# Altium project V3.PrjPcb (part 1 of 4)
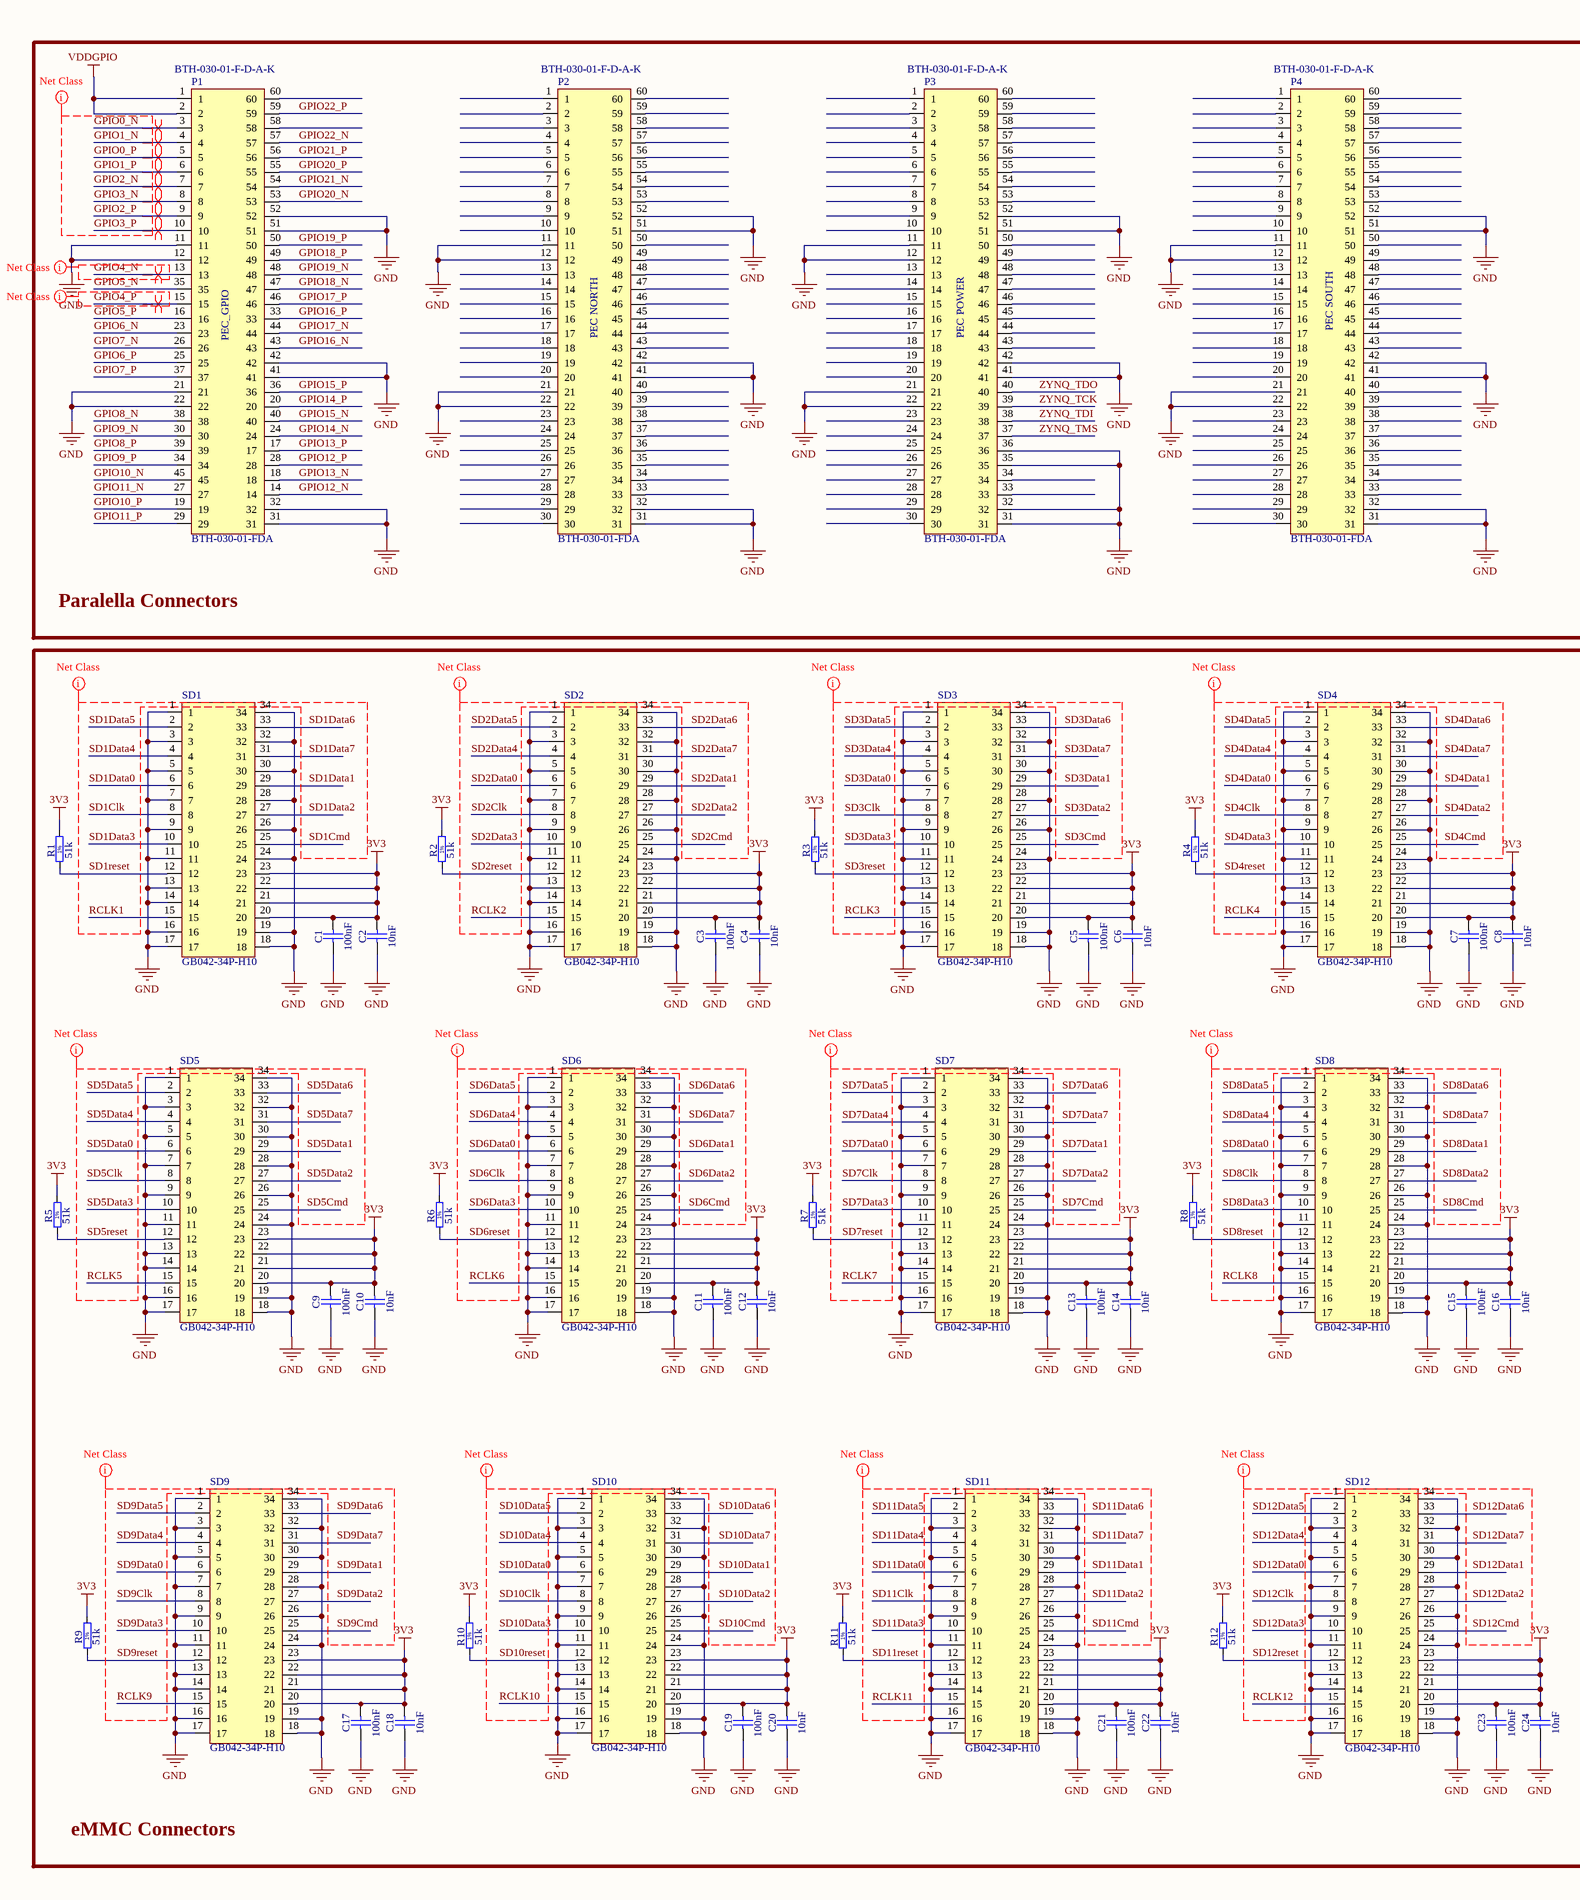
[diagram p0: Connectors.SchDoc, left]
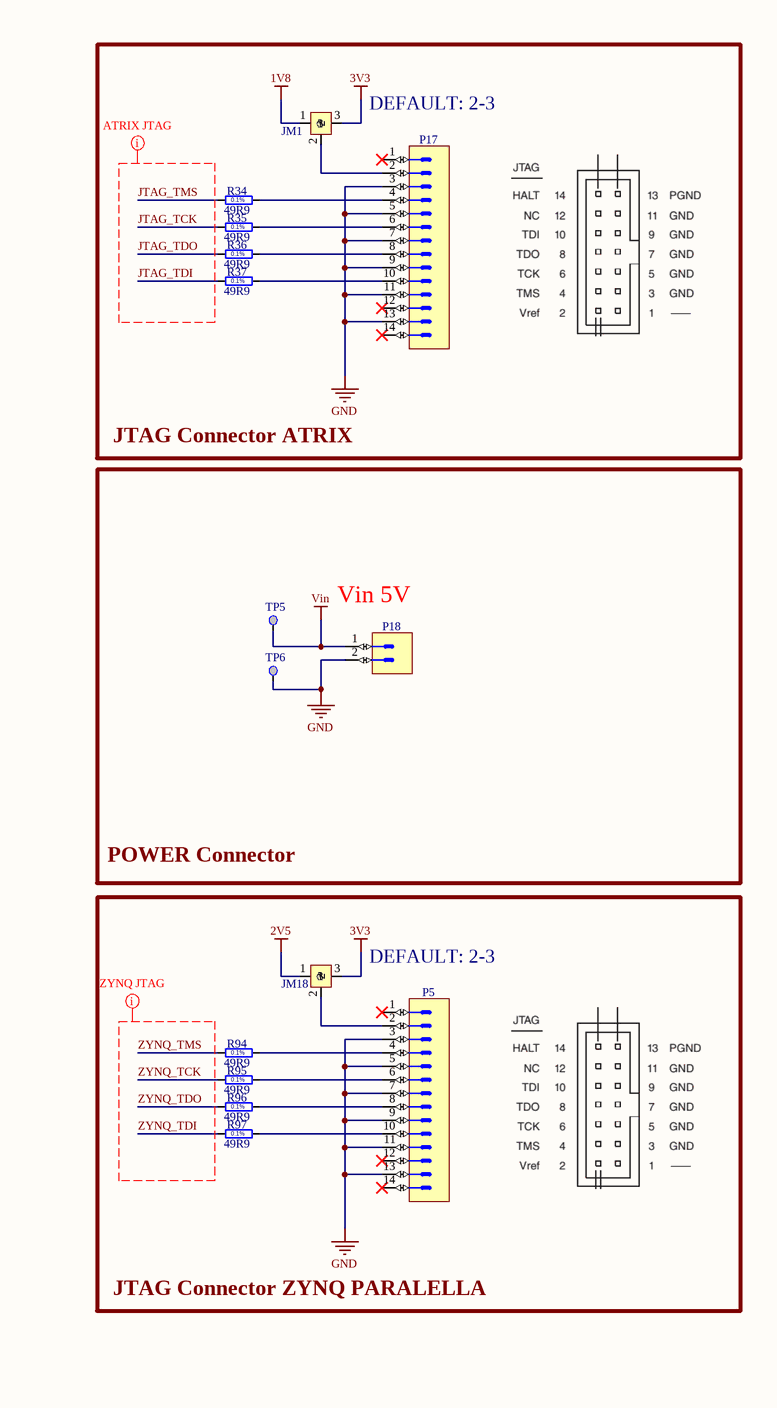
[diagram p1: Connectors.SchDoc, right]
5 sheets, 316 parts. Net scope: global (net labels, ports and power ports of the same name join across sheets).
Board file: PCB.PcbDoc
Sheets:
  Connectors.SchDoc
  WLAN.SchDoc
  ETH_Switch.SchDoc
    Filter = Filter.SchDoc
  Power.SchDoc

## Sheet Connectors.SchDoc
size A2

### Parts
C1  100nF  [CAPC1608X87N]
C2  10nF  [CAPC1608X87N]
C3  100nF  [CAPC1608X87N]
C4  10nF  [CAPC1608X87N]
C5  100nF  [CAPC1608X87N]
C6  10nF  [CAPC1608X87N]
C7  100nF  [CAPC1608X87N]
C8  10nF  [CAPC1608X87N]
C9  100nF  [CAPC1608X87N]
C10  10nF  [CAPC1608X87N]
C11  100nF  [CAPC1608X87N]
C12  10nF  [CAPC1608X87N]
C13  100nF  [CAPC1608X87N]
C14  10nF  [CAPC1608X87N]
C15  100nF  [CAPC1608X87N]
C16  10nF  [CAPC1608X87N]
C17  100nF  [CAPC1608X87N]
C18  10nF  [CAPC1608X87N]
C19  100nF  [CAPC1608X87N]
C20  10nF  [CAPC1608X87N]
C21  100nF  [CAPC1608X87N]
C22  10nF  [CAPC1608X87N]
C23  100nF  [CAPC1608X87N]
C24  10nF  [CAPC1608X87N]
JM1  Jumper 0R  [JUMPER_0R]  (value not drawn)
JM18  Jumper 0R  [JUMPER_0R]  (value not drawn)
P1  BTH-030-01-FDA  Manufacturer Part Number: BTH-030-01-F-D-A-K  [BTH-030-01-F-D-A]
P2  BTH-030-01-FDA  Manufacturer Part Number: BTH-030-01-F-D-A-K  [BTH-030-01-F-D-A]
P3  BTH-030-01-FDA  Manufacturer Part Number: BTH-030-01-F-D-A-K  [BTH-030-01-F-D-A]
P4  BTH-030-01-FDA  Manufacturer Part Number: BTH-030-01-F-D-A-K  [BTH-030-01-F-D-A]
P5  (no value)  [MOLEX_87832-1420]
P17  (no value)  [MOLEX_87832-1420]
P18  KK®  [MOLEX_26-60-4020]  (value not drawn)
R1  51k  [RESC1608X55N]
R2  51k  [RESC1608X55N]
R3  51k  [RESC1608X55N]
R4  51k  [RESC1608X55N]
R5  51k  [RESC1608X55N]
R6  51k  [RESC1608X55N]
R7  51k  [RESC1608X55N]
R8  51k  [RESC1608X55N]
R9  51k  [RESC1608X55N]
R10  51k  [RESC1608X55N]
R11  51k  [RESC1608X55N]
R12  51k  [RESC1608X55N]
R34  49R9  [RESC1608X55N]
R35  49R9  [RESC1608X55N]
R36  49R9  [RESC1608X55N]
R37  49R9  [RESC1608X55N]
R94  49R9  [RESC1608X55N]
R95  49R9  [RESC1608X55N]
R96  49R9  [RESC1608X55N]
R97  49R9  [RESC1608X55N]
SD1  GB042-34P-H10  [GB042-34P-H10]
SD2  GB042-34P-H10  [GB042-34P-H10]
SD3  GB042-34P-H10  [GB042-34P-H10]
SD4  GB042-34P-H10  [GB042-34P-H10]
SD5  GB042-34P-H10  [GB042-34P-H10]
SD6  GB042-34P-H10  [GB042-34P-H10]
SD7  GB042-34P-H10  [GB042-34P-H10]
SD8  GB042-34P-H10  [GB042-34P-H10]
SD9  GB042-34P-H10  [GB042-34P-H10]
SD10  GB042-34P-H10  [GB042-34P-H10]
SD11  GB042-34P-H10  [GB042-34P-H10]
SD12  GB042-34P-H10  [GB042-34P-H10]
TP5  TP  [TP]  (value not drawn)  (no BOM)
TP6  TP  [TP]  (value not drawn)  (no BOM)

### Blocks framed on the sheet
Paralella Connectors: P1-P4
JTAG Connector ATRIX: JM1 P17 R34-R37
Vin 5V: P18 TP5 TP6
eMMC Connectors: C1-C24 R1-R12 SD1-SD12
JTAG Connector ZYNQ PARALELLA: JM18 P5 R94-R97

### Nets
1V8: JM1.1
2V5: JM18.1
3V3: C1.2 C2.2 C3.2 C4.2 C5.2 C6.2 C7.2 C8.2 C9.2 C10.2 C11.2 C12.2 C13.2 C14.2 C15.2 C16.2 C17.2 C18.2 C19.2 C20.2 C21.2 C22.2 C23.2 C24.2 JM1.3 JM18.3 R1.2 R2.2 R3.2 R4.2 R5.2 R6.2 R7.2 R8.2 R9.2 R10.2 R11.2 R12.2 SD1.20 SD1.21 SD1.22 SD1.23 SD2.20 SD2.21 SD2.22 SD2.23 SD3.20 SD3.21 SD3.22 SD3.23 SD4.20 SD4.21 SD4.22 SD4.23 SD5.20 SD5.21 SD5.22 SD5.23 SD6.20 SD6.21 SD6.22 SD6.23 SD7.20 SD7.21 SD7.22 SD7.23 SD8.20 SD8.21 SD8.22 SD8.23 SD9.20 SD9.21 SD9.22 SD9.23 SD10.20 SD10.21 SD10.22 SD10.23 SD11.20 SD11.21 SD11.22 SD11.23 SD12.20 SD12.21 SD12.22 SD12.23
GND: C1.1 C2.1 C3.1 C4.1 C5.1 C6.1 C7.1 C8.1 C9.1 C10.1 C11.1 C12.1 C13.1 C14.1 C15.1 C16.1 C17.1 C18.1 C19.1 C20.1 C21.1 C22.1 C23.1 C24.1 P1.11 P1.12 P1.21 P1.22 P1.31 P1.32 P1.41 P1.42 P1.51 P1.52 P2.11 P2.12 P2.21 P2.22 P2.31 P2.32 P2.41 P2.42 P2.51 P2.52 P3.11 P3.12 P3.21 P3.22 P3.31 P3.32 P3.35 P3.36 P3.41 P3.42 P3.51 P3.52 P4.11 P4.12 P4.21 P4.22 P4.31 P4.32 P4.41 P4.42 P4.51 P4.52 P5.3 P5.5 P5.7 P5.9 P5.11 P5.13 P17.3 P17.5 P17.7 P17.9 P17.11 P17.13 P18.2 SD1.1 SD1.3 SD1.5 SD1.7 SD1.9 SD1.11 SD1.13 SD1.14 SD1.16 SD1.17 SD1.18 SD1.19 SD1.24 SD1.26 SD1.28 SD1.30 SD1.32 SD1.34 SD2.1 SD2.3 SD2.5 SD2.7 SD2.9 SD2.11 SD2.13 SD2.14 SD2.16 SD2.17 SD2.18 SD2.19 SD2.24 SD2.26 SD2.28 SD2.30 SD2.32 SD2.34 SD3.1 SD3.3 SD3.5 SD3.7 SD3.9 SD3.11 SD3.13 SD3.14 SD3.16 SD3.17 SD3.18 SD3.19 SD3.24 SD3.26 SD3.28 SD3.30 SD3.32 SD3.34 SD4.1 SD4.3 SD4.5 SD4.7 SD4.9 SD4.11 SD4.13 SD4.14 SD4.16 SD4.17 SD4.18 SD4.19 SD4.24 SD4.26 SD4.28 SD4.30 SD4.32 SD4.34 SD5.1 SD5.3 SD5.5 SD5.7 SD5.9 SD5.11 SD5.13 SD5.14 SD5.16 SD5.17 SD5.18 SD5.19 SD5.24 SD5.26 SD5.28 SD5.30 SD5.32 SD5.34 SD6.1 SD6.3 SD6.5 SD6.7 SD6.9 SD6.11 SD6.13 SD6.14 SD6.16 SD6.17 SD6.18 SD6.19 SD6.24 SD6.26 SD6.28 SD6.30 SD6.32 SD6.34 SD7.1 SD7.3 SD7.5 SD7.7 SD7.9 SD7.11 SD7.13 SD7.14 SD7.16 SD7.17 SD7.18 SD7.19 SD7.24 SD7.26 SD7.28 SD7.30 SD7.32 SD7.34 SD8.1 SD8.3 SD8.5 SD8.7 SD8.9 SD8.11 SD8.13 SD8.14 SD8.16 SD8.17 SD8.18 SD8.19 SD8.24 SD8.26 SD8.28 SD8.30 SD8.32 SD8.34 SD9.1 SD9.3 SD9.5 SD9.7 SD9.9 SD9.11 SD9.13 SD9.14 SD9.16 SD9.17 SD9.18 SD9.19 SD9.24 SD9.26 SD9.28 SD9.30 SD9.32 SD9.34 SD10.1 SD10.3 SD10.5 SD10.7 SD10.9 SD10.11 SD10.13 SD10.14 SD10.16 SD10.17 SD10.18 SD10.19 SD10.24 SD10.26 SD10.28 SD10.30 SD10.32 SD10.34 SD11.1 SD11.3 SD11.5 SD11.7 SD11.9 SD11.11 SD11.13 SD11.14 SD11.16 SD11.17 SD11.18 SD11.19 SD11.24 SD11.26 SD11.28 SD11.30 SD11.32 SD11.34 SD12.1 SD12.3 SD12.5 SD12.7 SD12.9 SD12.11 SD12.13 SD12.14 SD12.16 SD12.17 SD12.18 SD12.19 SD12.24 SD12.26 SD12.28 SD12.30 SD12.32 SD12.34 TP6.1
VDDGPIO: P1.1 P1.2
Vin: P18.1 TP5.1
GPIO0_N: P1.3
GPIO0_P: P1.5
GPIO1_N: P1.4
GPIO1_P: P1.6
GPIO2_N: P1.7
GPIO2_P: P1.9
GPIO3_N: P1.8
GPIO3_P: P1.10
GPIO4_N: P1.13
GPIO4_P: P1.15
GPIO5_N: P1.35
GPIO5_P: P1.16
GPIO6_N: P1.23
GPIO6_P: P1.25
GPIO7_N: P1.26
GPIO7_P: P1.37
GPIO8_N: P1.38
GPIO8_P: P1.39
GPIO9_N: P1.30
GPIO9_P: P1.34
GPIO10_N: P1.45
GPIO10_P: P1.19
GPIO11_N: P1.27
GPIO11_P: P1.29
GPIO12_N: P1.14
GPIO12_P: P1.28
GPIO13_N: P1.18
GPIO13_P: P1.17
GPIO14_N: P1.24
GPIO14_P: P1.20
GPIO15_N: P1.40
GPIO15_P: P1.36
GPIO16_N: P1.43
GPIO16_P: P1.33
GPIO17_N: P1.44
GPIO17_P: P1.46
GPIO18_N: P1.47
GPIO18_P: P1.49
GPIO19_N: P1.48
GPIO19_P: P1.50
GPIO20_N: P1.53
GPIO20_P: P1.55
GPIO21_N: P1.54
GPIO21_P: P1.56
GPIO22_N: P1.57
GPIO22_P: P1.59
JTAG_TCK: R35.1
JTAG_TDI: R37.1
JTAG_TDO: R36.1
JTAG_TMS: R34.1
RCLK1: SD1.15
RCLK2: SD2.15
RCLK3: SD3.15
RCLK4: SD4.15
RCLK5: SD5.15
RCLK6: SD6.15
RCLK7: SD7.15
RCLK8: SD8.15
RCLK9: SD9.15
RCLK10: SD10.15
RCLK11: SD11.15
RCLK12: SD12.15
SD1Clk: SD1.8
SD1Cmd: SD1.25
SD1Data0: SD1.6
SD1Data1: SD1.29
SD1Data2: SD1.27
SD1Data3: SD1.10
SD1Data4: SD1.4
SD1Data5: SD1.2
SD1Data6: SD1.33
SD1Data7: SD1.31
SD1reset: R1.1 SD1.12
SD2Clk: SD2.8
SD2Cmd: SD2.25
SD2Data0: SD2.6
SD2Data1: SD2.29
SD2Data2: SD2.27
SD2Data3: SD2.10
SD2Data4: SD2.4
SD2Data5: SD2.2
SD2Data6: SD2.33
SD2Data7: SD2.31
SD2reset: R2.1 SD2.12
SD3Clk: SD3.8
SD3Cmd: SD3.25
SD3Data0: SD3.6
SD3Data1: SD3.29
SD3Data2: SD3.27
SD3Data3: SD3.10
SD3Data4: SD3.4
SD3Data5: SD3.2
SD3Data6: SD3.33
SD3Data7: SD3.31
SD3reset: R3.1 SD3.12
SD4Clk: SD4.8
SD4Cmd: SD4.25
SD4Data0: SD4.6
SD4Data1: SD4.29
SD4Data2: SD4.27
SD4Data3: SD4.10
SD4Data4: SD4.4
SD4Data5: SD4.2
SD4Data6: SD4.33
SD4Data7: SD4.31
SD4reset: R4.1 SD4.12
SD5Clk: SD5.8
SD5Cmd: SD5.25
SD5Data0: SD5.6
SD5Data1: SD5.29
SD5Data2: SD5.27
SD5Data3: SD5.10
SD5Data4: SD5.4
SD5Data5: SD5.2
SD5Data6: SD5.33
SD5Data7: SD5.31
SD5reset: R5.1 SD5.12
SD6Clk: SD6.8
SD6Cmd: SD6.25
SD6Data0: SD6.6
SD6Data1: SD6.29
SD6Data2: SD6.27
SD6Data3: SD6.10
SD6Data4: SD6.4
SD6Data5: SD6.2
SD6Data6: SD6.33
SD6Data7: SD6.31
SD6reset: R6.1 SD6.12
SD7Clk: SD7.8
SD7Cmd: SD7.25
SD7Data0: SD7.6
SD7Data1: SD7.29
SD7Data2: SD7.27
SD7Data3: SD7.10
SD7Data4: SD7.4
SD7Data5: SD7.2
SD7Data6: SD7.33
SD7Data7: SD7.31
SD7reset: R7.1 SD7.12
SD8Clk: SD8.8
SD8Cmd: SD8.25
SD8Data0: SD8.6
SD8Data1: SD8.29
SD8Data2: SD8.27
SD8Data3: SD8.10
SD8Data4: SD8.4
SD8Data5: SD8.2
SD8Data6: SD8.33
SD8Data7: SD8.31
SD8reset: R8.1 SD8.12
SD9Clk: SD9.8
SD9Cmd: SD9.25
SD9Data0: SD9.6
SD9Data1: SD9.29
SD9Data2: SD9.27
SD9Data3: SD9.10
SD9Data4: SD9.4
SD9Data5: SD9.2
SD9Data6: SD9.33
SD9Data7: SD9.31
SD9reset: R9.1 SD9.12
SD10Clk: SD10.8
SD10Cmd: SD10.25
SD10Data0: SD10.6
SD10Data1: SD10.29
SD10Data2: SD10.27
SD10Data3: SD10.10
SD10Data4: SD10.4
SD10Data5: SD10.2
SD10Data6: SD10.33
SD10Data7: SD10.31
SD10reset: R10.1 SD10.12
SD11Clk: SD11.8
SD11Cmd: SD11.25
SD11Data0: SD11.6
SD11Data1: SD11.29
SD11Data2: SD11.27
SD11Data3: SD11.10
SD11Data4: SD11.4
SD11Data5: SD11.2
SD11Data6: SD11.33
SD11Data7: SD11.31
SD11reset: R11.1 SD11.12
SD12Clk: SD12.8
SD12Cmd: SD12.25
SD12Data0: SD12.6
SD12Data1: SD12.29
SD12Data2: SD12.27
SD12Data3: SD12.10
SD12Data4: SD12.4
SD12Data5: SD12.2
SD12Data6: SD12.33
SD12Data7: SD12.31
SD12reset: R12.1 SD12.12
ZYNQ_TCK: P3.39 R95.1
ZYNQ_TDI: P3.38 R97.1
ZYNQ_TDO: P3.40 R96.1
ZYNQ_TMS: P3.37 R94.1
NetJM1_2: JM1.2 P17.2
NetJM18_2: JM18.2 P5.2
NetP5_4: P5.4 R94.2
NetP5_6: P5.6 R95.2
NetP5_8: P5.8 R96.2
NetP5_10: P5.10 R97.2
NetP17_4: P17.4 R34.2
NetP17_6: P17.6 R35.2
NetP17_8: P17.8 R36.2
NetP17_10: P17.10 R37.2

Not connected (* = marked no-connect by the designer): P1 58 60 HOLE; P2 1 2 3 4 5 6 7 8 9 10 13 14 15 16 17 18 19 20 23 24 25 26 27 28 29 30 33 34 35 36 37 38 39 40 43 44 45 46 47 48 49 50 53 54 55 56 57 58 59 60 HOLE; P3 1 2 3 4 5 6 7 8 9 10 13 14 15 16 17 18 19 20 23 24 25 26 27 28 29 30 33 34 43 44 45 46 47 48 49 50 53 54 55 56 57 58 59 60 HOLE; P4 1 2 3 4 5 6 7 8 9 10 13 14 15 16 17 18 19 20 23 24 25 26 27 28 29 30 33 34 35 36 37 38 39 40 43 44 45 46 47 48 49 50 53 54 55 56 57 58 59 60 HOLE; P5 1* 12* 14* HOLE; P17 1* 12* 14* HOLE

### Layout directives
differential pair: GPIO0_N, GPIO0_P, GPIO1_N, GPIO1_P, GPIO2_N, GPIO2_P, GPIO3_N, GPIO3_P, GPIO4_N, GPIO4_P
net class SD1: RCLK1, SD1Clk, SD1Cmd, SD1Data0, SD1Data1, SD1Data2, SD1Data3, SD1Data4, SD1Data5, SD1Data6, SD1Data7, SD1reset
net class SD2: RCLK2, SD2Clk, SD2Cmd, SD2Data0, SD2Data1, SD2Data2, SD2Data3, SD2Data4, SD2Data5, SD2Data6, SD2Data7, SD2reset
net class SD3: RCLK3, SD3Clk, SD3Cmd, SD3Data0, SD3Data1, SD3Data2, SD3Data3, SD3Data4, SD3Data5, SD3Data6, SD3Data7, SD3reset
net class SD4: RCLK4, SD4Clk, SD4Cmd, SD4Data0, SD4Data1, SD4Data2, SD4Data3, SD4Data4, SD4Data5, SD4Data6, SD4Data7, SD4reset
net class SD5: RCLK5, SD5Clk, SD5Cmd, SD5Data0, SD5Data1, SD5Data2, SD5Data3, SD5Data4, SD5Data5, SD5Data6, SD5Data7, SD5reset
net class SD6: RCLK6, SD6Clk, SD6Cmd, SD6Data0, SD6Data1, SD6Data2, SD6Data3, SD6Data4, SD6Data5, SD6Data6, SD6Data7, SD6reset
net class SD7: RCLK7, SD7Clk, SD7Cmd, SD7Data0, SD7Data1, SD7Data2, SD7Data3, SD7Data4, SD7Data5, SD7Data6, SD7Data7, SD7reset
net class SD8: RCLK8, SD8Clk, SD8Cmd, SD8Data0, SD8Data1, SD8Data2, SD8Data3, SD8Data4, SD8Data5, SD8Data6, SD8Data7, SD8reset
net class SD9: RCLK9, SD9Clk, SD9Cmd, SD9Data0, SD9Data1, SD9Data2, SD9Data3, SD9Data4, SD9Data5, SD9Data6, SD9Data7, SD9reset
net class SD10: RCLK10, SD10Clk, SD10Cmd, SD10Data0, SD10Data1, SD10Data2, SD10Data3, SD10Data4, SD10Data5, SD10Data6, SD10Data7, SD10reset
net class SD11: RCLK11, SD11Clk, SD11Cmd, SD11Data0, SD11Data1, SD11Data2, SD11Data3, SD11Data4, SD11Data5, SD11Data6, SD11Data7, SD11reset
net class SD12: RCLK12, SD12Clk, SD12Cmd, SD12Data0, SD12Data1, SD12Data2, SD12Data3, SD12Data4, SD12Data5, SD12Data6, SD12Data7, SD12reset
net class GPIO: GPIO0_N, GPIO0_P, GPIO1_N, GPIO1_P, GPIO2_N, GPIO2_P, GPIO3_N, GPIO3_P, GPIO4_N, GPIO4_P
net class ZYNQ JTAG: ZYNQ_TCK, ZYNQ_TDI, ZYNQ_TDO, ZYNQ_TMS
net class ATRIX JTAG: JTAG_TCK, JTAG_TDI, JTAG_TDO, JTAG_TMS

### Notes on the sheet
- DEFAULT: 2-3
- (near P1) PEC_GPIO
- (near P2) PEC NORTH
- (near P3) PEC POWER
- (near P4) PEC SOUTH
- POWER Connector
- Title
- Size:
- Date:
- File:
- A2
- Number:
- Time:
- Revision:
- Sheet
- of
- (in symbol R0603_49R9_0.1%_0.063W_10PPM) 0.1%
- (in symbol R0603_51K_1%_0.1W_100PPM) 1%

### Library data of the parts
C1 C3 C5 C7 C9 C11 C13 C15 C17 C19 C21 C23 = CC0603_100NF_50V_10%_X7R: Non-polarised capacitor; Part Description: SMD Multilayer Chip Ceramic Capacitor; Manufacturer: MULTICOMP; Manufacturer Part Number: MCB0603R104KCT; Manufacturer1 Part Number: 223858615649; Voltage: 50V; TC: X7R; Tolerance: ±10%; Table: Capacitors SMD; Voltage Rating: 16; Capacitance: 0.1; SVHC: No SVHC (17-Dec-2015); Ceramic Capacitor Case: 0603 [1608 Metric]; Dielectric Characteristic: X7; Product Range: MCB Series; Capacitance Tolerance: ± 10%; Capacitor Terminals: SMD; Description: MULTICOMP - MCB0603R104KCT - CAP, MLCC, X7R, 100NF, 16V, 0603; Part Number: CC0603_100NF_50V_10%_X7R; Component Kind: Standard; Component Type: Standard; Pin Count: 2; Value: 100nF; Status: Preferred; Case: 0603; Mounted: Yes; Socket: No; SMD: Yes; Manufacturer1 Example: PHYCOMP; Manufacturer1 ComponentHeight: 0.87mm; HelpURL: \\cern.ch\dfs\Applications\Altium\Datasheets\CC0603_X7R_PHYCOMP.pdf; Author: CERN DEM JLC; CreateDate: 3.12.2007; LatestRevisionDate: 3.12.2007; RoHS: YES; Packaging: Cut Tape; Operating Temperature Min: -55; MSL: -; Supplier Part Number: 9406140; Operating Temperature Range: -55°C to +125°C<!--FANDB--><div class="features-and-benefits-container"><div class="features-and-benefits-description"><span class="features-benefits-value">The MCB0603R104KCT is a multilayer Ceramic Capacitor with 0603 chip, for general digital circuit. Consists of a conducting material and electrodes. To manufacture a chip-type SMT and achieve miniaturization, high density and high efficiency, ceramic condensers are used. MLCC is made by X7; Supplier: Farnell; Capacitance Tolerance ±: ± 10%; Operating Temperature Max: 125
C2 C4 C6 C8 C10 C12 C14 C16 C18 C20 C22 C24 = CC0603_10NF_50V_10%_X7R: Non-polarised capacitor; Part Description: SMD Multilayer Chip Ceramic Capacitor; Manufacturer: MULTICOMP; Manufacturer Part Number: MC0603B103K500CT; Manufacturer1 Part Number: 223858615636; Voltage: 50V; TC: X7R; Tolerance: ±10%; Table: Capacitors SMD; Voltage Rating: 50; Product Range: MC Series; No. of Pins: 2; Capacitor Terminals: SMD; Ceramic Capacitor Case: 0603 [1608 Metric]; SVHC: No SVHC (17-Dec-2015); Capacitance Tolerance ±: ± 10%; External Length / Height: 0.8; Dielectric Characteristic: X7; External Depth: 1.6; Description: MULTICOMP - MC0603B103K500CT - CAP, MLCC, X7R, 10NF, 50V, 0603; Capacitance: 0.01; Part Number: CC0603_10NF_50V_10%_X7R; Component Kind: Standard; Component Type: Standard; Pin Count: 2; Value: 10nF; Status: Preferred; Case: 0603; Mounted: Yes; Socket: No; SMD: Yes; Manufacturer1 Example: PHYCOMP; Manufacturer1 ComponentHeight: 0.87mm; HelpURL: \\cern.ch\dfs\Applications\Altium\Datasheets\CC0603_X7R_PHYCOMP.pdf; Author: CERN DEM JLC; CreateDate: 3.12.2007; LatestRevisionDate: 3.12.2007; Operating Temperature Range: -55°C to +125°C<!--FANDB--><div class="features-and-benefits-container"><div class="features-and-benefits-description"><span class="features-benefits-value">The Multicomp MC series is general purpose MLCC capacitors with X7R dielectric material which provides high electrical precision, stability and reliability. This MLCC capacitor consists of a conducting material and electrodes with high density and high efficiency ceramic condensers.</span></div><div class="features-and-benefits-list"><ul class="features-and-benefits-list-list"><li class="features-and-benefits-list-item">Small size with higher capacitance values</li><li class="features-and-benefits-list-item">0201, 0402, 0603, 0805, 1206, 1210, 1812 case sizes available</li><li class="features-and-benefits-list-item">Capacitance value ranging from 100pF to 47?F</li><li class="features-and-benefits-list-item">Capacitor with lead free termination (pure Tin)</li><li class="features-and-benefits-list-item">High electrical precision, stability and reliability</li><li class="features-and-benefits-list-item">Rated voltage of 6.3V, 10V, 16V, 25V, 50V, 100V</li><li class="features-and-benefits-list-item">Operating temperature of -55°C to +125°C</li><li class="features-and-benefits-list-item">Available in ±5%, ±10% and ±20; MSL: -; Supplier: Farnell; Capacitance Tolerance: ± 10%; External Width: 0.8; Supplier Part Number: 1759102; Packaging: Cut Tape; Operating Temperature Max: 125; Operating Temperature Min: -55; RoHS: YES
P1-P4 = BTH-030-01-FDA: Connector Parallela; Manufacturer: Samtec; Description: Conn Micro Terminal HDR 60 POS 0.5mm Solder ST SMD; Octopart Url: http://octopart.com/bth-030-01-f-d-a-k-samtec-10613276; OctopartID: 57659ece801f88a2; Supplier: Octopart; Seller Landing  Url: https://octopart-clicks.com/click/track?country=TR&ak=8157f166&sig=0dabfe7&sid=15544&ppid=10613276&vpid=76082636&ct=offers; Supplier Part Number: Avnet Europe - BTH-030-01-F-D-A-K
P5 P17 = Connector 14 Male: Manufacturer Part Number: 0878321420; Manufacturer: Molex, LLC; Connector Type: Header, Shrouded; Number of Positions: 14; Number of Positions Loaded: All; Pitch: 0.079" (2.00mm); Category: Connectors, Interconnects; Supplier Part Number: WM18641-ND; Supplier: Digi-Key; RoHS: RoHS Compliant; Packaging: Tube; Contact Type: Male Pin; Number of Rows: 2; Row Spacing: 0.079" (2.00mm); Contact Mating Length: 0.141" (3.60mm); Mounting Type: Surface Mount; Termination: Solder; Fastening Type: -; Features: Board Guide; Contact Finish: Gold; Contact Finish Thickness: 15µin (0.38µm); Color: Black
P18 = MOLEX_26-60-4020: Connector 2 Male; Part Description: 3.96mm (.156") Pitch KK® Solid Header, Vertical, Friction Lock, 2 Circuits, Tin (Sn) Plating; Manufacturer: Molex, LLC; Manufacturer Part Number: 0026604020; Table: MOLEX; Number of Positions: 2; Connector Type: Header, Unshrouded; Pitch: 0.156" (3.96mm); Number of Positions Loaded: All; Part Number: MOLEX_26-60-4020; Component Kind: Standard; Component Type: Standard; Pin Count: 2; Family: KK®; Mounted: Yes; Socket: No; SMD: No; Status: None; ComponentHeight: 14.73mm; HelpURL: \\cern.ch\dfs\Applications\Altium\Datasheets\MOLEX_26-60-4020.pdf; Author: CERN DEM JLC; CreateDate: 6.04.2011; LatestRevisionDate: 6.04.2011; Contact Mating Length: 0.450" (11.43mm); Termination: Solder; Fastening Type: Friction Lock; Supplier Part Number: WM4620-ND; Contact Finish Thickness: 60µin (1.52µm); Mounting Type: Through Hole; Contact Type: Male Pin; Row Spacing: -; Supplier: Digi-Key; Contact Finish: Tin; Number of Rows: 1; RoHS: RoHS Compliant; Packaging: Bulk; Category: Connectors, Interconnects; Features: -; Color: Natural
R1-R12 = R0603_51K_1%_0.1W_100PPM: Resistor - 1%; Part Description: General Purpose Thick Film Chip Resistor; Manufacturer: Yageo; Manufacturer Part Number: RC0603JR-0751KL; Manufacturer1 Part Number: NRC06F5102TRF; Power: 0.1W; TC: ±100ppm/°C; Tolerance: ±5%; Table: Resistors SMD; Description: RES SMD 51K OHM 5% 1/10W 0603; Power (Watts): 0.1W, 1/10W; Part Number: R0603_51K_1%_0.1W_100PPM; Component Kind: Standard; Component Type: Standard; Pin Count: 2; Value: 51k; Status: Preferred; Case: 0603; Mounted: Yes; Socket: No; SMD: Yes; Manufacturer1 Example: NIC COMPONENT; Manufacturer1 ComponentHeight: 0.55mm; HelpURL: \\cern.ch\dfs\Applications\Altium\Datasheets\R0603_NIC_NRC.pdf; Author: CERN DEM JLC; CreateDate: 3.12.2007; LatestRevisionDate: 13.03.2008; Height: 0.022" (0.55mm); Features: Moisture Resistant; RoHS: RoHS Compliant; Number of Terminations: 2; Category: Resistors; Composition: Thick Film; Resistance (Ohms): 51k; Size / Dimension: 0.063" L x 0.031" W (1.60mm x 0.80mm); Supplier Part Number: 311-51KGRCT-ND; Supplier Device Package: 0603; Package / Case: 0603 (1608 Metric); Supplier: Digi-Key; Temperature Coefficient: ±100ppm/°C; Packaging: Cut Tape (CT); Operating Temperature: -55°C ~ 155°C
R34-R37 R94-R97 = R0603_49R9_0.1%_0.063W_10PPM: Resistor - 0.1%; Part Description: Thin Film Chip Resistor; Manufacturer: Panasonic Electronic Components; Manufacturer Part Number: ERJ-3EKF49R9V; Manufacturer1 Part Number: RN73C1J49R9BTDF; Power: 0.063W; TC: ±10ppm; Tolerance: ±1%; Table: Resistors SMD; Power (Watts): 0.1W, 1/10W; Resistance (Ohms): 49.9; Description: RES SMD 49.9 OHM 1% 1/10W 0603; Temperature Coefficient: ±100ppm/°C; Part Number: R0603_49R9_0.1%_0.063W_10PPM; Component Kind: Standard; Component Type: Standard; Pin Count: 2; Value: 49R9; Status: Not recommended; Case: 0603; Mounted: Yes; Socket: No; SMD: Yes; Manufacturer1 Example: TYCO HOLSWORTHY; Manufacturer1 ComponentHeight: 0.5mm; HelpURL: \\cern.ch\dfs\Applications\Altium\Datasheets\R0603_Tyco_RN73.pdf; Author: CERN DEM JLC; CreateDate: 3.12.2007; LatestRevisionDate: 13.03.2008; Package / Case: 0603 (1608 Metric); Category: Resistors; Supplier: Digi-Key; Number of Terminations: 2; Packaging: Cut Tape (CT); Composition: Thick Film; Supplier Device Package: 0603; Height: 0.022" (0.55mm); Size / Dimension: 0.063" L x 0.031" W (1.60mm x 0.80mm); Features: Automotive AEC-Q200; Supplier Part Number: P49.9HCT-ND; RoHS: RoHS Compliant; Operating Temperature: -55°C ~ 155°C
SD1-SD12 = GB042-34P-H10: Connector, eMMC
TP5 TP6 = Test Point

## Sheet WLAN.SchDoc
size A3
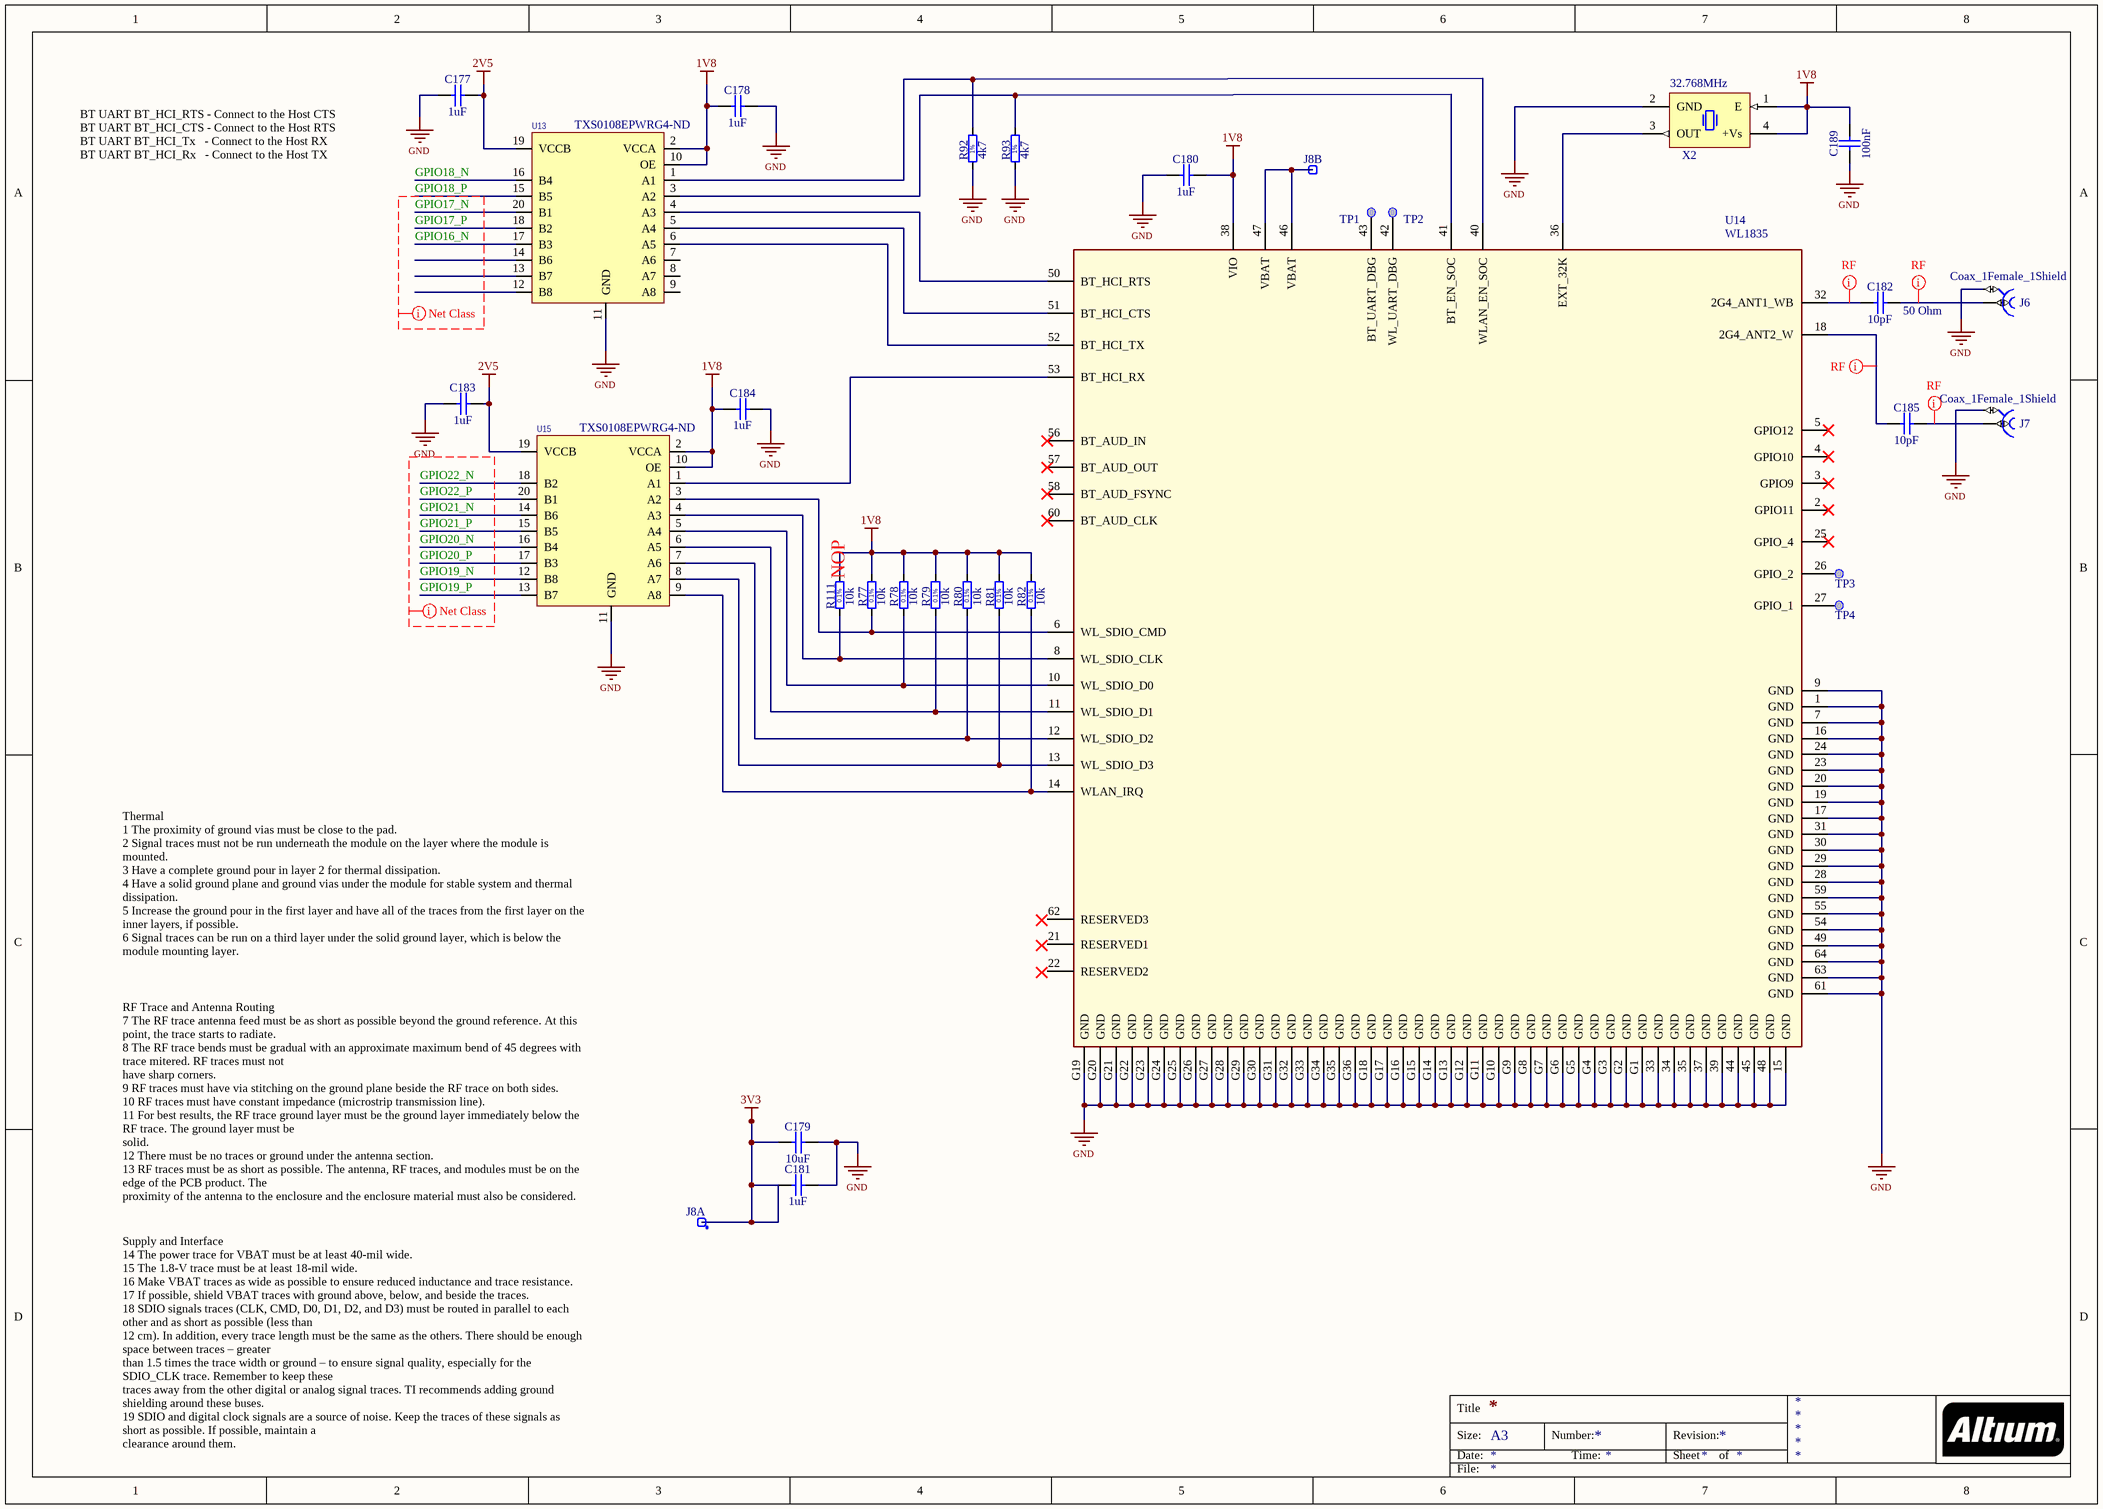
[diagram p2: WLAN.SchDoc]

### Parts
C177  1uF  [CAPC1608X87N]
C178  1uF  [CAPC1608X87N]
C179  10uF  [CAPC2012X135N]
C180  1uF  [CAPC1608X87N]
C181  1uF  [CAPC1608X87N]
C182  10pF  [CAPC1608X87N]
C183  1uF  [CAPC1608X87N]
C184  1uF  [CAPC1608X87N]
C185  10pF  [CAPC1608X87N]
C189  100nF  [CAPC1608X87N]
J6  Coax_1Female_1Shield  [HUBER-SUHNER_82 SMA-50-0-41/133 NE]
J7  Coax_1Female_1Shield  [HUBER-SUHNER_82 SMA-50-0-41/133 NE]
J8  Test Point  [COMATEL_385.0358.1.02.400]  (value not drawn)  (parts A,B of 2)
R77  10k  [RESC1608X55N]
R78  10k  [RESC1608X55N]
R79  10k  [RESC1608X55N]
R80  10k  [RESC1608X55N]
R81  10k  [RESC1608X55N]
R82  10k  [RESC1608X55N]
R92  4k7  [RESC1608X55N]
R93  4k7  [RESC1608X55N]
R111  10k  [RESC1608X55N]
TP1  TP  [TP]  (value not drawn)  (no BOM)
TP2  TP  [TP]  (value not drawn)  (no BOM)
TP3  TP  [TP]  (value not drawn)  (no BOM)
TP4  TP  [TP]  (value not drawn)  (no BOM)
U13  Supplier Part Number: TXS0108EPWRG4-ND  [SOP65P640X120-20N]  (hidden comment: TXS0108EPWR)
U14  WL1835  [E-13.4X13.3-N100_0.75-TOP]
U15  Supplier Part Number: TXS0108EPWRG4-ND  [SOP65P640X120-20N]  (hidden comment: TXS0108EPWR)
X2  32.768MHz  [OSCSC508P500X700X180-4N]

### Nets
1V8: C178.1 C180.2 C184.1 C189.2 R77.2 R78.2 R79.2 R80.2 R81.2 R82.2 R111.2 U13.2(VCCA) U13.10(OE) U14.38(VIO) U15.2(VCCA) U15.10(OE) X2.1(E) X2.4(+Vs)
2V5: C177.2 C183.2 U13.19(VCCB) U15.19(VCCB)
3V3: C179.1 C181.1 J8.1
GND: C177.1 C178.2 C179.2 C180.1 C181.2 C183.1 C184.2 C189.1 J6.2 J7.2 R92.1 R93.1 U13.11(GND) U14.1(GND) U14.7(GND) U14.9(GND) U14.15(GND) U14.16(GND) U14.17(GND) U14.19(GND) U14.20(GND) U14.23(GND) U14.24(GND) U14.28(GND) U14.29(GND) U14.30(GND) U14.31(GND) U14.33(GND) U14.34(GND) U14.35(GND) U14.37(GND) U14.39(GND) U14.44(GND) U14.45(GND) U14.48(GND) U14.49(GND) U14.54(GND) U14.55(GND) U14.59(GND) U14.61(GND) U14.63(GND) U14.64(GND) U14.G1(GND) U14.G2(GND) U14.G3(GND) U14.G4(GND) U14.G5(GND) U14.G6(GND) U14.G7(GND) U14.G8(GND) U14.G9(GND) U14.G10(GND) U14.G11(GND) U14.G12(GND) U14.G13(GND) U14.G14(GND) U14.G15(GND) U14.G16(GND) U14.G17(GND) U14.G18(GND) U14.G19(GND) U14.G20(GND) U14.G21(GND) U14.G22(GND) U14.G23(GND) U14.G24(GND) U14.G25(GND) U14.G26(GND) U14.G27(GND) U14.G28(GND) U14.G29(GND) U14.G30(GND) U14.G31(GND) U14.G32(GND) U14.G33(GND) U14.G34(GND) U14.G35(GND) U14.G36(GND) U15.11(GND) X2.2(GND)
GPIO16_N: U13.17(B3)
GPIO17_N: U13.20(B1)
GPIO17_P: U13.18(B2)
GPIO18_N: U13.16(B4)
GPIO18_P: U13.15(B5)
GPIO19_N: U15.12(B8)
GPIO19_P: U15.13(B7)
GPIO20_N: U15.16(B4)
GPIO20_P: U15.17(B3)
GPIO21_N: U15.14(B6)
GPIO21_P: U15.15(B5)
GPIO22_N: U15.18(B2)
GPIO22_P: U15.20(B1)
NetC182_1: C182.1 U14.32(2G4_ANT1_WB)
NetC182_2: C182.2 J6.1
NetC185_1: C185.1 U14.18(2G4_ANT2_W)
NetC185_2: C185.2 J7.1
NetJ8_2: J8.2 U14.46(VBAT) U14.47(VBAT)
NetR77_1: R77.1 U14.6(WL_SDIO_CMD) U15.3(A2)
NetR78_1: R78.1 U14.10(WL_SDIO_D0) U15.5(A4)
NetR79_1: R79.1 U14.11(WL_SDIO_D1) U15.6(A5)
NetR80_1: R80.1 U14.12(WL_SDIO_D2) U15.7(A6)
NetR81_1: R81.1 U14.13(WL_SDIO_D3) U15.8(A7)
NetR82_1: R82.1 U14.14(WLAN_IRQ) U15.9(A8)
NetR92_2: R92.2 U13.1(A1) U14.40(WLAN_EN_SOC)
NetR93_2: R93.2 U13.3(A2) U14.41(BT_EN_SOC)
NetR111_1: R111.1 U14.8(WL_SDIO_CLK) U15.4(A3)
NetTP1_1: TP1.1 U14.43(BT_UART_DBG)
NetTP2_1: TP2.1 U14.42(WL_UART_DBG)
NetTP3_1: TP3.1 U14.26(GPIO_2)
NetTP4_1: TP4.1 U14.27(GPIO_1)
NetU13_4: U13.4(A3) U14.50(BT_HCI_RTS)
NetU13_5: U13.5(A4) U14.51(BT_HCI_CTS)
NetU13_6: U13.6(A5) U14.52(BT_HCI_TX)
NetU14_36: U14.36(EXT_32K) X2.3(OUT)
NetU14_53: U14.53(BT_HCI_RX) U15.1(A1)

Not connected (* = marked no-connect by the designer): U13 7(A6) 8(A7) 9(A8) 12(B8) 13(B7) 14(B6); U14 2(GPIO11)* 3(GPIO9)* 4(GPIO10)* 5(GPIO12)* 21(RESERVED1) 22(RESERVED2) 25(GPIO_4)* 56(BT_AUD_IN)* 57(BT_AUD_OUT)* 58(BT_AUD_FSYNC)* 60(BT_AUD_CLK)* 62(RESERVED3)

### Layout directives
net class RF: NetC182_1, NetC182_2, NetC185_1, NetC185_2
net class WLAN_SPI: GPIO19_N, GPIO19_P, GPIO20_N, GPIO20_P, GPIO21_N, GPIO21_P, GPIO22_N, GPIO22_P
net class BLU_SPI: GPIO16_N, GPIO17_N, GPIO17_P, GPIO18_P

### Notes on the sheet
- BT UART	BT_HCI_RTS - Connect to the Host CTS
  BT UART	BT_HCI_CTS - Connect to the Host RTS
  BT UART	BT_HCI_Tx   - Connect to the Host RX
  BT UART	BT_HCI_Rx   - Connect to the Host TX
- (near C182) 50 Ohm
- (near R111) NOP
- Thermal
  1 The proximity of ground vias must be close to the pad.
  2 Signal traces must not be run underneath the module on the layer where the module is mounted.
  3 Have a complete ground pour in layer 2 for thermal dissipation.
  4 Have a solid ground plane and ground vias under the module for stable system and thermal dissipation.
  5 Increase the ground pour in the first layer and have all of the traces from the first layer on the inner layers, if possible.
  6 Signal traces can be run on a third layer under the solid ground layer, which is below the module mounting layer.
- RF Trace and Antenna Routing
  7 The RF trace antenna feed must be as short as possible beyond the ground reference. At this point, the trace starts to radiate.
  8 The RF trace bends must be gradual with an approximate maximum bend of 45 degrees with trace mitered. RF traces must not
  have sharp corners.
  9 RF traces must have via stitching on the ground plane beside the RF trace on both sides.
  10 RF traces must have constant impedance (microstrip transmission line).
  11 For best results, the RF trace ground layer must be the ground layer immediately below the RF trace. The ground layer must be
  solid.
  12 There must be no traces or ground under the antenna section.
  13 RF traces must be as short as possible. The antenna, RF traces, and modules must be on the edge of the PCB product. The
  proximity of the antenna to the enclosure and the enclosure material must also be considered.
- Supply and Interface
  14 The power trace for VBAT must be at least 40-mil wide.
  15 The 1.8-V trace must be at least 18-mil wide.
  16 Make VBAT traces as wide as possible to ensure reduced inductance and trace resistance.
  17 If possible, shield VBAT traces with ground above, below, and beside the traces.
  18 SDIO signals traces (CLK, CMD, D0, D1, D2, and D3) must be routed in parallel to each other and as short as possible (less than
  12 cm). In addition, every trace length must be the same as the others. There should be enough space between traces – greater
  than 1.5 times the trace width or ground – to ensure signal quality, especially for the SDIO_CLK trace. Remember to keep these
  traces away from the other digital or analog signal traces. TI recommends adding ground shielding around these buses.
  19 SDIO and digital clock signals are a source of noise. Keep the traces of these signals as short as possible. If possible, maintain a
  clearance around them.
- Title
- Size:
- Date:
- A3
- Number:
- Time:
- Revision:
- Sheet
- of
- File:
- (in symbol R0603_4K7_1%_0.1W_100PPM) 1%
- (in symbol R0603_10K_0.1%_0.063W_10PPM) 0.1%

### Library data of the parts
C177 C178 C180 C181 C183 C184 = CC0603_1UF_25V_10%_X7R: Non-polarised capacitor; Part Description: SMD Multilayer Chip Ceramic Capacitor; Manufacturer: MULTICOMP; Manufacturer Part Number: MC0603F104Z250CT; Manufacturer1 Part Number: GRM188R71E105KA12D; Voltage: 25V; TC: X7R; Tolerance: ±10%; Table: Capacitors SMD; Capacitance: 0.1; Capacitance Tolerance: +80%, -20%; No. of Pins: 2; Product Range: MC Series; External Length / Height: 0.8; Dielectric Characteristic: Y5; Ceramic Capacitor Case: 0603 [1608 Metric]; Capacitor Terminals: SMD; External Depth: 1.6; SVHC: No SVHC (17-Dec-2015); Voltage Rating: 25; Part Number: CC0603_1UF_25V_10%_X7R; Component Kind: Standard; Component Type: Standard; Pin Count: 2; Value: 1uF; Status: None; Case: 0603; Mounted: Yes; Socket: No; SMD: Yes; Manufacturer1 Example: MURATA; Manufacturer1 ComponentHeight: 0.9mm; HelpURL: \\cern.ch\dfs\Applications\Altium\Datasheets\CC0603_X7R_MURATA.pdf; Author: CERN DEM JLC; CreateDate: 18.01.2011; LatestRevisionDate: 18.01.2011; MSL: -; Supplier Part Number: 1759038; Capacitance Tolerance ±: +80%, -20%; External Width: 0.8; Operating Temperature Range: -25°C to +85°C<!--FANDB--><div class="features-and-benefits-container"><div class="features-and-benefits-description"><span class="features-benefits-value">The MC0603F104Z250CT is a general purpose Multilayer Ceramic Capacitor with Cu/Ni/Sn-plated termination, Y5V dielectric and 0603 case. The multilayer ceramic capacitor consists of a conducting material and electrodes. To manufacture a chip-type SMT and achieve miniaturization, high density and high efficiency, ceramic condensers are used. High electrical precision, stability and reliability.</span></div><div class="features-and-benefits-list"><ul class="features-and-benefits-list-list"><li class="features-and-benefits-list-item">High capacitance</li></ul></div><div class="features-and-benefits-applications"><ul class="features-and-benefits-value"><li class="features-and-benefits-list-item">Power Management</li><li class="features-and-benefits-list-item">Consumer Electronics</li><li class="features-and-benefits-list-item">Communications & Networking</li></ul></div></div>; Supplier: Farnell; Packaging: Cut Tape; Operating Temperature Max: 85; Operating Temperature Min: -30; RoHS: YES
C179 = CC0805_10UF_10V_10%_X7R: Non-polarised capacitor; Part Description: SMD Multilayer Chip Ceramic Capacitor; Manufacturer: MULTICOMP; Manufacturer Part Number: MC0805X106K250CT; Manufacturer1 Part Number: GRM21BR71A106KE51L; Voltage: 10V; TC: X7R; Tolerance: ±10%; Table: Capacitors SMD; Product Range: MC Series; Voltage Rating: 25; Capacitor Terminals: SMD<!--FANDB--><div class="features-and-benefits-container"><div class="features-and-benefits-description"><span class="features-benefits-value">The MC series from Multicomp are general purpose MLCC capacitors with X5R dielectric material which provides high electrical precision, stability and reliability. This MLCC capacitor consists of a conducting material and electrodes with high density and high efficiency ceramic condensers.</span></div><div class="features-and-benefits-list"><ul class="features-and-benefits-list-list"><li class="features-and-benefits-list-item">Small size with higher capacitance values</li><li class="features-and-benefits-list-item">0201, 0402, 0603, 0805, 1206, 1210, 1812 case sizes available</li><li class="features-and-benefits-list-item">Capacitance values ranges from 100pF to 220?F</li><li class="features-and-benefits-list-item">Capacitor with lead free termination (pure Tin)</li><li class="features-and-benefits-list-item">High electrical precision, stability and reliability</li><li class="features-and-benefits-list-item">Rated voltage of 4V, 6.3V, 10V, 16V, 25V, 50V</li><li class="features-and-benefits-list-item">Operating temperature range -55°C to +85°C</li><li class="features-and-benefits-list-item">Available in ±10% and ±20; Dielectric Characteristic: X5; Ceramic Capacitor Case: 0805 [2012 Metric]; Capacitance Tolerance ±: ± 10%; SVHC: No SVHC (15-Jun-2015); Capacitance: 10; Part Number: CC0805_10UF_10V_10%_X7R; Component Kind: Standard; Component Type: Standard; Pin Count: 2; Value: 10uF; Status: Preferred; Case: 0805; Mounted: Yes; Socket: No; SMD: Yes; Manufacturer1 Example: MURATA; Manufacturer1 ComponentHeight: 1.35mm; HelpURL: \\cern.ch\dfs\Applications\Altium\Datasheets\CC0805_X7R_MURATA.pdf; Author: CERN DEM JLC; CreateDate: 30.04.2012; LatestRevisionDate: 30.04.2012; Operating Temperature Min: -55; MSL: MSL 1 - Unlimited; Supplier: Farnell; RoHS: YES; Capacitance Tolerance: ± 10%; Packaging: Cut Tape; Supplier Part Number: 2320833; Operating Temperature Max: 85
C182 C185 = CC0603_10PF_50V_5%_NP0: Non-polarised capacitor; Part Description: SMD Multilayer Chip Ceramic Capacitor; Manufacturer: Yageo; Manufacturer Part Number: CC0603JRNPO9BN100; Manufacturer1 Part Number: 223886715109; Voltage: 50V; TC: NP0; Tolerance: ±5%; Table: Capacitors SMD; Temperature Coefficient: C0G, NP0; Part Number: CC0603_10PF_50V_5%_NP0; Component Kind: Standard; Component Type: Standard; Pin Count: 2; Value: 10pF; Status: Preferred; Case: 0603; Mounted: Yes; Socket: No; SMD: Yes; Manufacturer1 Example: PHYCOMP; Manufacturer1 ComponentHeight: 0.87mm; HelpURL: \\cern.ch\dfs\Applications\Altium\Datasheets\CC0603_NP0_PHYCOMP.pdf; Author: CERN DEM JLC; CreateDate: 3.12.2007; LatestRevisionDate: 3.12.2007; Packaging: Tape & Reel (TR); Features: -; RoHS: RoHS Compliant; Applications: General Purpose; Category: Capacitors; Operating Temperature: -55°C ~ 125°C; Height - Seated (Max): -; Supplier Part Number: 311-1058-2-ND; Ratings: -; Lead Style: -; Thickness (Max): 0.035" (0.90mm); Lead Spacing: -; Mounting Type: Surface Mount, MLCC; Size / Dimension: 0.063" L x 0.031" W (1.60mm x 0.80mm); Voltage - Rated: 50V; Supplier: Digi-Key; Package / Case: 0603 (1608 Metric); Capacitance: 10pF
C189 = CC0603_100NF_50V_10%_X7R: Non-polarised capacitor; Part Description: SMD Multilayer Chip Ceramic Capacitor; Manufacturer: MULTICOMP; Manufacturer Part Number: MCB0603R104KCT; Manufacturer1 Part Number: 223858615649; Voltage: 50V; TC: X7R; Tolerance: ±10%; Table: Capacitors SMD; Voltage Rating: 16; Capacitance Tolerance ±: ± 10%; Dielectric Characteristic: X7; Capacitance: 0.1; SVHC: No SVHC (17-Dec-2015); Capacitor Terminals: SMD; Ceramic Capacitor Case: 0603 [1608 Metric]; Product Range: MCB Series; Part Number: CC0603_100NF_50V_10%_X7R; Component Kind: Standard; Component Type: Standard; Pin Count: 2; Value: 100nF; Status: Preferred; Case: 0603; Mounted: Yes; Socket: No; SMD: Yes; Manufacturer1 Example: PHYCOMP; Manufacturer1 ComponentHeight: 0.87mm; HelpURL: \\cern.ch\dfs\Applications\Altium\Datasheets\CC0603_X7R_PHYCOMP.pdf; Author: CERN DEM JLC; CreateDate: 03.12.2007; LatestRevisionDate: 03.12.2007; Supplier: Farnell; Capacitance Tolerance: ± 10%; Supplier Part Number: 9406140; RoHS: YES; Packaging: Cut Tape; MSL: -; Operating Temperature Max: 125; Operating Temperature Range: -55°C to +125°C<!--FANDB--><div class="features-and-benefits-container"><div class="features-and-benefits-description"><span class="features-benefits-value">The MCB0603R104KCT is a multilayer Ceramic Capacitor with 0603 chip, for general digital circuit. Consists of a conducting material and electrodes. To manufacture a chip-type SMT and achieve miniaturization, high density and high efficiency, ceramic condensers are used. MLCC is made by X7; Operating Temperature Min: -55
J6 J7 = HUBER-SUHNER_82_SMA-50-0-41/133_NE: Part Description: SMA 50 Ohms Straight PCB Jack; Manufacturer: AMPHENOL CONNEX; Manufacturer Part Number: 132134; Table: Miscellaneous; Part Number: HUBER-SUHNER_82_SMA-50-0-41/133_NE; Component Kind: Standard; Component Type: Standard; Pin Count: 2; Family: SMA; Mounted: Yes; Socket: No; SMD: No; Status: None; ComponentHeight: 9.6mm; HelpURL: \\cern.ch\dfs\Applications\Altium\Datasheets\HUBER-SUHNER_82 SMA-50-0-41-133 NE.pdf; Author: CERN DEM JLC; CreateDate: 20.04.2010; LatestRevisionDate: 27.04.2010; Supplier: Farnell; RoHS: YES; Supplier Part Number: 2112465
J8 = COMATEL_385.0358.1.02.400: 2 Mini Wire-Wrap Contact Strip Header; Part Description: 2 Contacts Straight Strip Header Pitch 2.54mm L=6.3mm ''Mini-Wire-Wrap''; Manufacturer: KONTEK COMATEL; Part Number: COMATEL_385.0358.1.02.400; Component Kind: Standard; Component Type: Standard; Pin Count: 2; Family: Test Point; Mounted: Yes; Socket: No; SMD: No; Status: Not recommended; Manufacturer Part Number: 385.0358.1.02.400; ComponentHeight: 8mm; HelpURL: \\cern.ch\dfs\Applications\Altium\Datasheets\COMATEL_385.0358.1.02.400.pdf; Author: CERN DEM JLC; CreateDate: 30.06.2010; LatestRevisionDate: 10.10.2012; Table: COMATEL
R77-R82 R111 = R0603_10K_0.1%_0.063W_10PPM: Resistor - 0.1%; Part Description: Thin Film Chip Resistor; Manufacturer: Panasonic Electronic Components; Manufacturer Part Number: ERJ-3GEYJ103V; Manufacturer1 Part Number: RN73C1J10KBTDF; Power: 0.063W; TC: ±10ppm; Tolerance: ±5%; Table: Resistors SMD; Description: RES SMD 10K OHM 5% 1/10W 0603; Temperature Coefficient: ±200ppm/°C; Power (Watts): 0.1W, 1/10W; Part Number: R0603_10K_0.1%_0.063W_10PPM; Component Kind: Standard; Component Type: Standard; Pin Count: 2; Value: 10k; Status: Not recommended; Case: 0603; Mounted: Yes; Socket: No; SMD: Yes; Manufacturer1 Example: TYCO HOLSWORTHY; Manufacturer1 ComponentHeight: 0.5mm; HelpURL: \\cern.ch\dfs\Applications\Altium\Datasheets\R0603_Tyco_RN73.pdf; Author: CERN DEM JLC; CreateDate: 3.12.2007; LatestRevisionDate: 13.03.2008; Supplier: Digi-Key; Supplier Part Number: P10KGDKR-ND; Category: Resistors; Height: 0.022" (0.55mm); Operating Temperature: -55°C ~ 155°C; Number of Terminations: 2; Composition: Thick Film; Features: Automotive AEC-Q200; RoHS: RoHS Compliant; Supplier Device Package: 0603; Size / Dimension: 0.063" L x 0.031" W (1.60mm x 0.80mm); Packaging: Digi-Reel®; Resistance (Ohms): 10k; Package / Case: 0603 (1608 Metric)
R92 R93 = R0603_4K7_1%_0.1W_100PPM: Resistor - 1%; Part Description: General Purpose Thick Film Chip Resistor; Manufacturer: Yageo; Manufacturer Part Number: RC0603JR-074K7L; Manufacturer1 Part Number: NRC06F4701TRF; Power: 0.1W; TC: ±100ppm/°C; Tolerance: ±5%; Table: Resistors SMD; Resistance (Ohms): 4.7k; Power (Watts): 0.1W, 1/10W; Part Number: R0603_4K7_1%_0.1W_100PPM; Component Kind: Standard; Component Type: Standard; Pin Count: 2; Value: 4k7; Status: Preferred; Case: 0603; Mounted: Yes; Socket: No; SMD: Yes; Manufacturer1 Example: NIC COMPONENT; Manufacturer1 ComponentHeight: 0.55mm; HelpURL: \\cern.ch\dfs\Applications\Altium\Datasheets\R0603_NIC_NRC.pdf; Author: CERN DEM JLC; CreateDate: 3.12.2007; LatestRevisionDate: 13.03.2008; Size / Dimension: 0.063" L x 0.031" W (1.60mm x 0.80mm); Supplier Device Package: 0603; Supplier: Digi-Key; Features: Moisture Resistant; Package / Case: 0603 (1608 Metric); Category: Resistors; Temperature Coefficient: ±100ppm/°C; Number of Terminations: 2; Packaging: Cut Tape (CT); Height: 0.022" (0.55mm); Composition: Thick Film; RoHS: RoHS Compliant; Operating Temperature: -55°C ~ 155°C; Supplier Part Number: 311-4.7KGRCT-ND
TP1-TP4 = Test Point
U13 U15 = TXS0108EPWR: IC 8BIT NON-INV TRANSLTR 20TSSOP; Manufacturer Part Number: TXS0108EPWRG4; Manufacturer: Texas Instruments; Voltage - VCCA: 1.2 V ~ 3.6 V; Channels per Circuit: 8; Output Type: Open Drain, Push-Pull; Channel Type: Bidirectional; Data Rate: 60Mbps; Voltage - VCCB: 1.65 V ~ 5.5 V; Number of Circuits: 1; Translator Type: Voltage Level; Features: Auto-Direction Sensing; Mounting Type: Surface Mount; Output Signal: -; RoHS: RoHS Compliant; Input Signal: -; Packaging: Tape & Reel (TR); Operating Temperature: -40°C ~ 85°C (TA); Supplier: Digi-Key; Category: Integrated Circuits (ICs); Package / Case: 20-TSSOP (0.173", 4.40mm Width); Supplier Device Package: 20-TSSOP
U14 = WL1835: MODULE WIFI WILINK; Manufacturer Part Number: WL1835MODGBMOCR; Manufacturer: Texas Instruments; Voltage - Supply: 2.9 V ~ 4.8 V; Power - Output: 17.3dBm; Sensitivity: -96.3dBm; Protocol: 802.11a/b/g/n, Bluetooth v4.1 Low Energy (BLE); Frequency: 2.4GHz ~ 2.48GHz; Current - Receiving: 85mA; Data Rate: 100Mbps; RF Family/Standard: Bluetooth, WiFi; Current - Transmitting: 420mA; Antenna Type: Integrated, Chip; Serial Interfaces: UART; Category: RF/IF and RFID; Modulation: -; Memory Size: -; Supplier: Digi-Key; RoHS: RoHS Compliant By Exemption; Packaging: Tape & Reel (TR); Package / Case: Module; Operating Temperature: -40°C ~ 85°C; Mounting Type: Surface Mount; Supplier Part Number: 296-38032-2-ND
X2 = OSC_32.7688MHZ_RAKON_LF SPXO019203: Oscillator 4 pins 1=E 2=GND 3=OUT 4=+Vs; Part Description: 3.3V ±50ppm Tri-State Surface Mount HCCMOS Clock Oscillator (CFPS-73 Serie); Manufacturer: EPSON; Manufacturer Part Number: SG-3030JF 32.7680KB0: ROHS; Table: Crystals & Oscillators; Frequency: 32.768kHz; Output: CMOS; Voltage - Supply: 1.5 V ~ 5.5 V; Current - Supply (Max): 2µA; Part Number: OSC_32.7688MHZ_RAKON_LF SPXO019203; Component Kind: Standard; Component Type: Standard; PackageDescription: SMD Oscillator, side convave, 4 pins, 5.00x7.00mm; Value: 32.768MHz; Pin Count: 4; Mounted: Yes; Socket: No; SMD: Yes; ComponentHeight: 2mm; HelpURL: \\cern.ch\dfs\Applications\Altium\Datasheets\OSC_RAKON_CFPS.pdf; Author: CERN DEM JLC; CreateDate: 5.10.2009; LatestRevisionDate: 5.10.2009; Category: Crystals and Oscillators; Supplier Part Number: SG-3030JF 32.7680KB0: ROHS-ND; Supplier: Digi-Key; RoHS: RoHS Compliant; Packaging: Tape & Reel (TR); Type: XO (Standard); Function: -; Frequency Stability: -; Operating Temperature: -20°C ~ 70°C; Ratings: -; Mounting Type: Surface Mount; Size / Dimension: 0.280" L x 0.181" W (7.10mm x 4.60mm); Height: 0.059" (1.50mm); Package / Case: 4-SOJ; Current - Supply (Disable) (Max): -